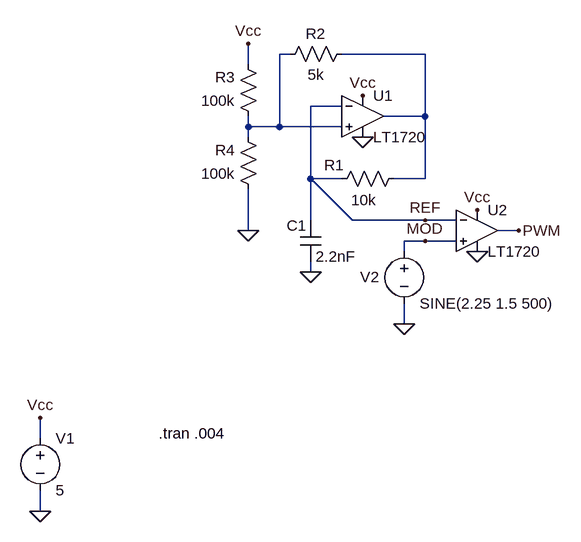
[diagram p0: schematic OL_classic_pwm.asc]
OL_classic_pwm.asc, the LTspice schematic file:
Version 4
SHEET 1 880 680
WIRE -256 -384 -272 -384
WIRE -48 -384 -176 -384
WIRE -320 -368 -320 -400
WIRE -176 -304 -224 -304
WIRE -48 -288 -48 -384
WIRE -48 -288 -112 -288
WIRE -320 -272 -320 -288
WIRE -272 -272 -272 -384
WIRE -272 -272 -320 -272
WIRE -176 -272 -272 -272
WIRE -320 -256 -320 -272
WIRE -224 -192 -224 -304
WIRE -176 -192 -224 -192
WIRE -48 -192 -48 -288
WIRE -48 -192 -96 -192
WIRE -224 -128 -224 -192
WIRE -160 -128 -224 -192
WIRE -48 -128 -160 -128
WIRE 0 -128 -48 -128
WIRE -320 -112 -320 -176
WIRE 96 -112 64 -112
WIRE -48 -96 -80 -96
WIRE 0 -96 -48 -96
WIRE -80 -80 -80 -96
WIRE -224 -48 -224 -64
WIRE -80 32 -80 0
WIRE -640 208 -640 176
WIRE -640 320 -640 288
FLAG -640 176 Vcc
FLAG -144 -320 Vcc
FLAG 32 -144 Vcc
FLAG 32 -80 0
FLAG -144 -256 0
FLAG -640 320 0
FLAG -80 32 0
FLAG -224 -48 0
FLAG -320 -400 Vcc
FLAG -320 -112 0
FLAG 96 -112 PWM
FLAG -48 -128 REF
FLAG -48 -96 MOD
SYMBOL voltage -640 192 R0
WINDOW 123 0 0 Left 0
WINDOW 39 0 0 Left 0
SYMATTR InstName V1
SYMATTR Value 5
SYMBOL Comparators\\LT1720 -144 -352 R0
SYMATTR InstName U1
SYMBOL Comparators\\LT1720 32 -176 R0
SYMATTR InstName U2
SYMBOL voltage -80 -96 R0
WINDOW 0 -68 55 Left 2
WINDOW 123 0 0 Left 0
WINDOW 39 0 0 Left 0
SYMATTR InstName V2
SYMATTR Value SINE(2.25 1.5 500)
SYMBOL cap -240 -128 R0
WINDOW 0 -21 8 Left 2
SYMATTR InstName C1
SYMATTR Value 2.2nF
SYMBOL res -80 -208 R90
WINDOW 0 11 108 VBottom 2
WINDOW 3 33 62 VTop 2
SYMATTR InstName R1
SYMATTR Value 10k
SYMBOL res -160 -400 R90
WINDOW 0 0 56 VBottom 2
WINDOW 3 32 56 VTop 2
SYMATTR InstName R2
SYMATTR Value 5k
SYMBOL res -304 -272 R180
WINDOW 0 36 76 Left 2
WINDOW 3 36 40 Left 2
SYMATTR InstName R3
SYMATTR Value 100k
SYMBOL res -304 -160 R180
WINDOW 0 36 76 Left 2
WINDOW 3 36 40 Left 2
SYMATTR InstName R4
SYMATTR Value 100k
TEXT -458 200 Left 2 !.tran .004

The netlist it stands for:
* OL_classic_pwm.asc
V1 Vcc 0 5
XU1 N001 REF Vcc 0 N002 LT1720  ; pins In+ In- V+ V- OUT
XU2 MOD REF Vcc 0 PWM LT1720  ; pins In+ In- V+ V- OUT
V2 MOD 0 SINE(2.25 1.5 500)
C1 REF 0 2.2nF
R1 N002 REF 10k
R2 N002 N001 5k
R3 N001 Vcc 100k
R4 0 N001 100k
.tran .004
.lib LT1720.sub
.backanno
.end